# Altium project Prueba_1.PrjPcb
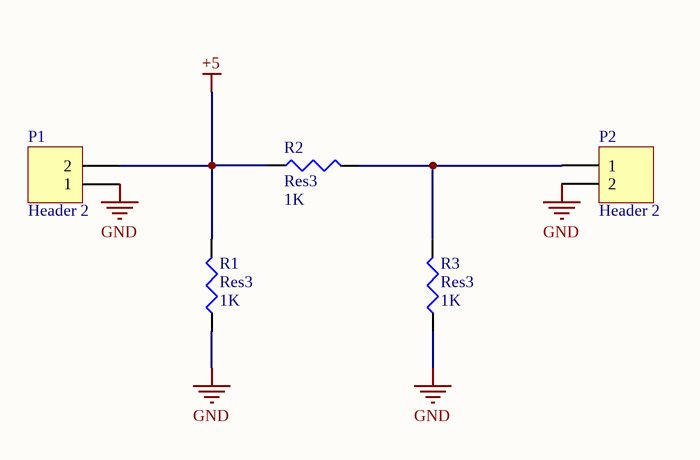
[diagram p0: SCH1.SchDoc]
1 sheet, 5 parts. Net scope: global (net labels, ports and power ports of the same name join across sheets).
Board file: PCB1.PcbDoc

## Sheet SCH1.SchDoc
size A4

### Parts
P1  Header 2  [HDR1X2]
P2  Header 2  [HDR1X2]
R1  Res3  value 1K  [J1-0603]
R2  Res3  value 1K  [J1-0603]
R3  Res3  value 1K  [J1-0603]

### Nets
+5: P1.2 R1.2 R2.1
GND: P1.1 P2.2 R1.1 R3.1
NetP2_1: P2.1 R2.2 R3.2

### Library data of the parts
P1 P2 = Header 2: Header, 2-Pin; LatestRevisionDate: 17-Jul-2002; LatestRevisionNote: Re-released for DXP Platform.; Publisher: Altium Limited
R1-R3 = Res3: Resistor; Published: 8-Jun-2000; LatestRevisionDate: 29-May-2009; LatestRevisionNote: IPC-7351 Footprint Added.; PackageReference: J1-0603; Publisher: Altium Limited; PackageDescription: Chip Resistor